# EAGLE schematic walter (EAGLE 9.6.2)
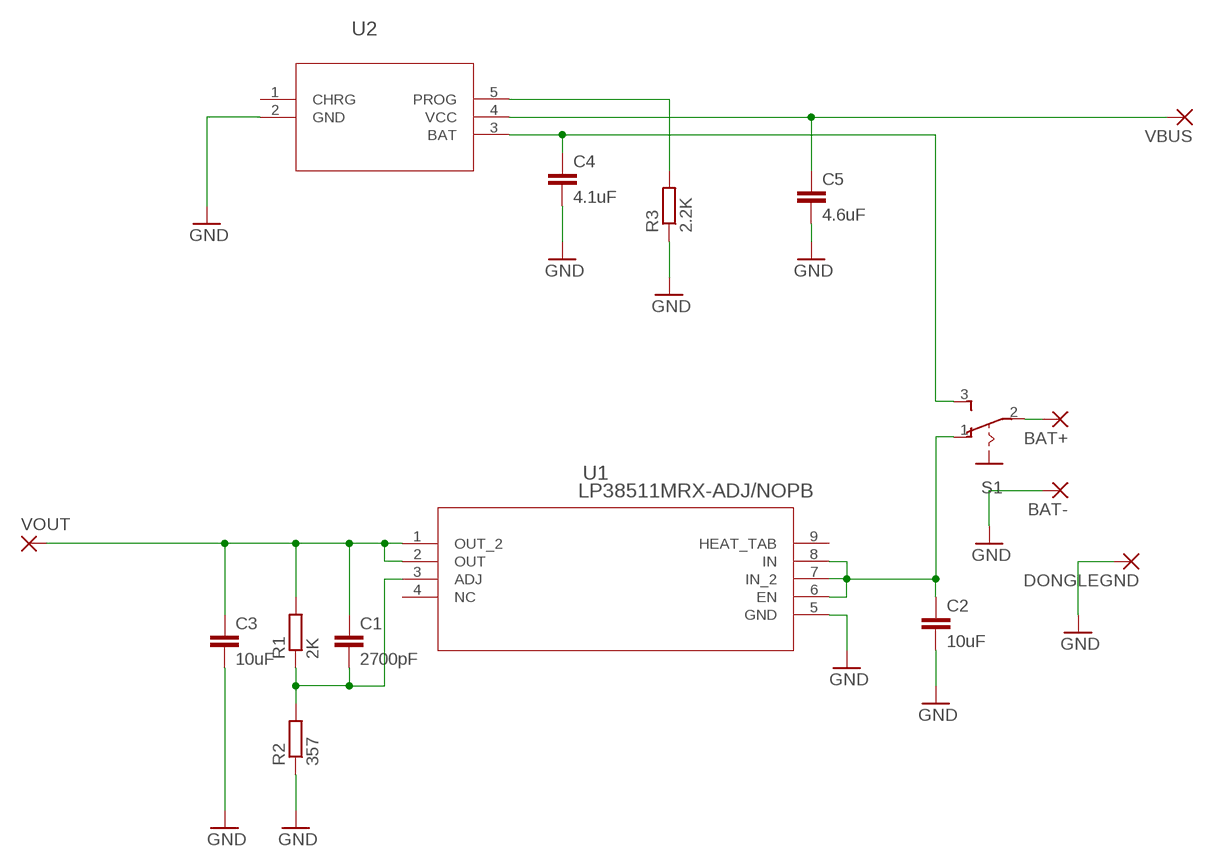
[diagram p0: schematic, sheet 1]

## Parts
BAT+  1,6/0,8  [1,6/0,8]
BAT-  1,6/0,8  [1,6/0,8]
C1  2700pF  C-EUC0402  [C0402]
C2  10uF  C-EUC0603  [C0603]
C3  10uF  C-EUC0603  [C0603]
C4  4.1uF  C-EUC0603  [C0603]
C5  4.6uF  C-EUC0603  [C0603]
DONGLEGND  1,6/0,8  [1,6/0,8]
R1  2K  R-EU_R0402  [R0402]
R2  357  R-EU_R0603  [R0603]
R3  2.2K  R-EU_R0603  [R0603]
S1  255SB  [255SB]
U1  LP38511MRX-ADJ/NOPB  [MRA08B_TEX]
U2  LTC4054LES5-4.2TRPBF  [S_5_ADI]
VBUS  1,6/0,8  [1,6/0,8]
VOUT  1,6/0,8  [1,6/0,8]

## Nets
GND: BAT-.1(P) C2.2 C3.2 C4.2 C5.2 DONGLEGND.1(P) R2.1 R3.1 U1.5(GND) U2.2(GND)
N$1: C2.1 S1.1(O) U1.6(EN) U1.7(IN_2) U1.8(IN)
N$2: C4.1 S1.3(S) U2.3(BAT)
N$3: C1.1 C3.1 R1.2 U1.1(OUT_2) U1.2(OUT) VOUT.1(P)
N$4: C1.2 R1.1 R2.2 U1.3(ADJ)
N$5: BAT+.1(P) S1.2(P)
N$6: R3.2 U2.5(PROG)
N$7: C5.1 U2.4(VCC) VBUS.1(P)
Unconnected: U1.4(NC) U1.9(HEAT_TAB) U2.1(CHRG)

## Library data of the parts
BAT+ BAT- DONGLEGND VBUS VOUT = wirepad:1,6/0,8: THROUGH-HOLE PAD
C1-C5 = rcl:C-EU: CAPACITOR, European symbol; SPICEPREFIX: C
R1-R3 = rcl:R-EU_: RESISTOR, European symbol; SPICEPREFIX: R
S1 = switch:255SB: SLIDING SWITCH Distributor Buerklin, 11G810
U1 = LP38511MRX-ADJ:NOPB:LP38511MRX-ADJ/NOPB; BUILT_BY: EMA_UL_Team; MANUFACTURER_PART_NUMBER: LP38511MRX-ADJ/NOPB; SOURCELIBRARY: National_2014-06-20; VENDOR: Texas Instruments
U2 = LTC4054:LTC4054LES5-4.2TRPBF; BUILT_BY: EMA_Jessica; COPYRIGHT: Copyright (C) 2016 Accelerated Designs. All rights reserved; MANUFACTURER_PART_NUMBER: LTC4054LES5-4.2#TRPBF; SOURCELIBRARY: Analog_Devices_2018-09-28; VENDOR: Analog Devices Inc

## Net classes
0 default: width 0.356 mm